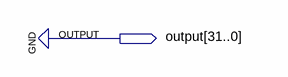
[diagram p0: schematic sheet]
// Quartus schematic ZeroGenerator.bdf as structural Verilog: 0 symbols, 1 pins
module ZeroGenerator (
  output [31:0] \output 
);


  assign \output  = {32{1'b0}};
endmodule
